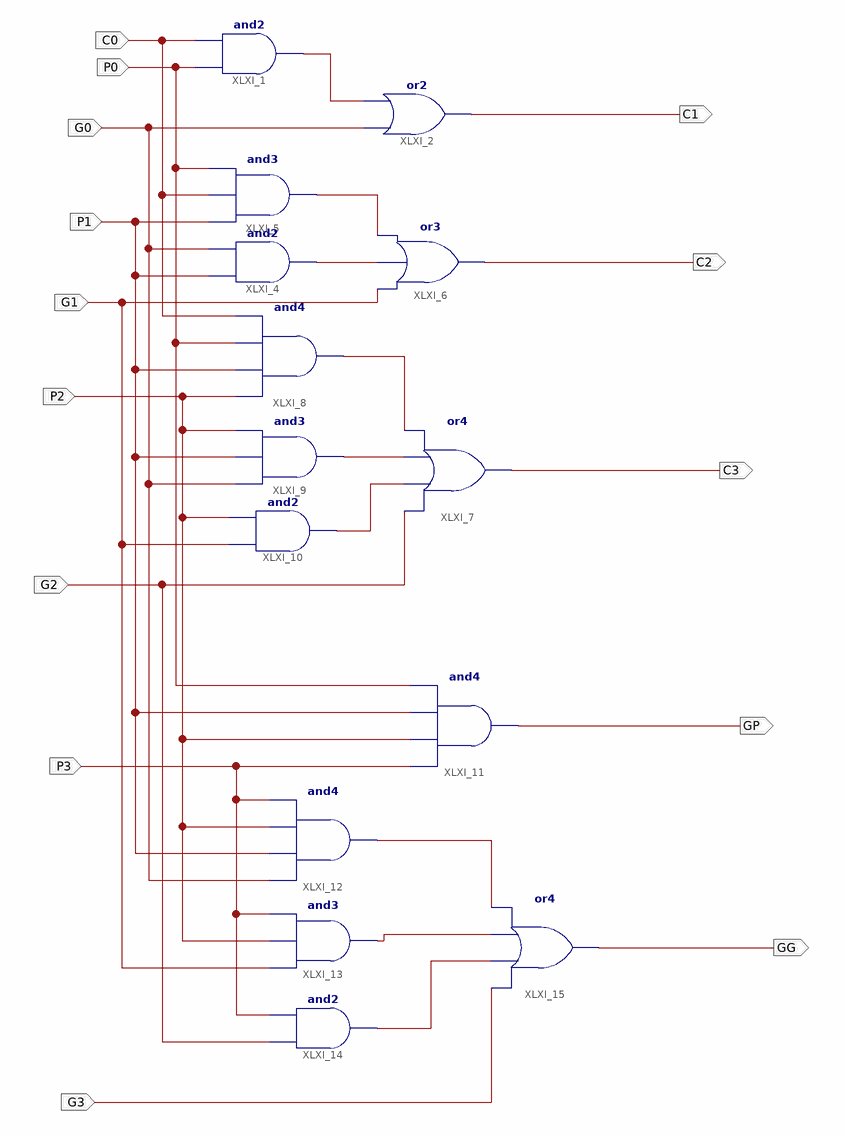
[diagram p0: schematic sheet 1]
// Xilinx ISE schematic CLA.sch (spartan6) as structural Verilog: 14 symbols, 14 ports
module CLA (
  input  C0,
  input  P0,
  input  G0,
  input  P1,
  input  G1,
  input  P2,
  input  G2,
  input  P3,
  input  G3,
  output C1,
  output C2,
  output C3,
  output GP,
  output GG
);

  wire XLXN_1, XLXN_12, XLXN_13, XLXN_25, XLXN_26, XLXN_27, XLXN_44, XLXN_46, XLXN_47;

  and XLXI_1 (XLXN_1, P0, C0);
  or XLXI_2 (C1, G0, XLXN_1);
  and XLXI_4 (XLXN_13, P1, G0);
  and XLXI_5 (XLXN_12, P1, C0, P0);
  or XLXI_6 (C2, G1, XLXN_13, XLXN_12);
  or XLXI_7 (C3, G2, XLXN_27, XLXN_26, XLXN_25);
  and XLXI_8 (XLXN_25, P2, P1, P0, C0);
  and XLXI_9 (XLXN_26, G0, P1, P2);
  and XLXI_10 (XLXN_27, G1, P2);
  and XLXI_11 (GP, P3, P2, P1, P0);
  and XLXI_12 (XLXN_44, G0, P1, P2, P3);
  and XLXI_13 (XLXN_46, G1, P2, P3);
  and XLXI_14 (XLXN_47, G2, P3);
  or XLXI_15 (GG, G3, XLXN_47, XLXN_46, XLXN_44);
endmodule
